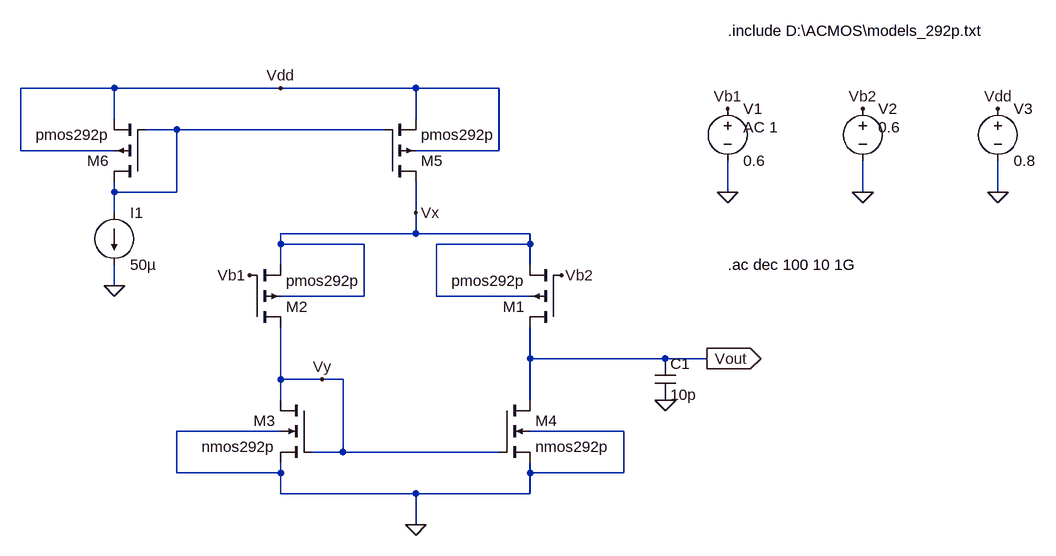
[diagram p0: schematic 5T_OTA_pmos.asc]
5T_OTA_pmos.asc, the LTspice schematic file:
Version 4.1
SHEET 1 1120 680
WIRE -304 -176 -448 -176
WIRE -48 -176 -304 -176
WIRE 160 -176 -48 -176
WIRE 288 -176 160 -176
WIRE -304 -128 -304 -176
WIRE 160 -128 160 -176
WIRE -208 -112 -256 -112
WIRE 112 -112 -208 -112
WIRE -448 -80 -448 -176
WIRE -304 -80 -448 -80
WIRE 288 -80 288 -176
WIRE 288 -80 160 -80
WIRE -304 -16 -304 -32
WIRE -208 -16 -208 -112
WIRE -208 -16 -304 -16
WIRE 640 -16 640 -64
WIRE 848 -16 848 -64
WIRE 1056 -16 1056 -64
WIRE -304 16 -304 -16
WIRE 160 16 160 -32
WIRE 160 48 160 16
WIRE 160 48 -48 48
WIRE 336 48 160 48
WIRE -48 64 -48 48
WIRE 80 64 -48 64
WIRE 336 64 336 48
WIRE 336 64 192 64
WIRE -48 96 -48 64
WIRE 336 96 336 64
WIRE -304 128 -304 96
WIRE 80 144 80 64
WIRE 80 144 -48 144
WIRE 192 144 192 64
WIRE 336 144 192 144
WIRE 336 240 336 192
WIRE 544 240 336 240
WIRE 608 240 544 240
WIRE -48 272 -48 192
WIRE 16 272 -48 272
WIRE 48 272 16 272
WIRE -48 304 -48 272
WIRE 336 304 336 240
WIRE -48 352 -208 352
WIRE 480 352 336 352
WIRE 48 384 48 272
WIRE 48 384 0 384
WIRE 288 384 48 384
WIRE -208 416 -208 352
WIRE -48 416 -48 400
WIRE -48 416 -208 416
WIRE 336 416 336 400
WIRE 480 416 480 352
WIRE 480 416 336 416
WIRE -48 448 -48 416
WIRE 160 448 -48 448
WIRE 336 448 336 416
WIRE 336 448 160 448
WIRE 160 496 160 448
FLAG 160 496 0
FLAG -304 128 0
FLAG 640 -16 0
FLAG 848 -16 0
FLAG 1056 -16 0
FLAG 640 -144 Vb1
FLAG 848 -144 Vb2
FLAG 1056 -144 Vdd
FLAG -96 112 Vb1
FLAG 384 112 Vb2
FLAG 608 240 Vout
IOPIN 608 240 Out
FLAG -48 -176 Vdd
FLAG 160 16 Vx
FLAG 16 272 Vy
FLAG 544 304 0
SYMBOL pmos4 384 192 R180
SYMATTR InstName M1
SYMATTR Value pmos292p
SYMATTR Value2 l=180n w=2.81532E-06
SYMBOL pmos4 -96 192 M180
SYMATTR InstName M2
SYMATTR Value pmos292p
SYMATTR Value2 l=180n w=2.81532E-06
SYMBOL nmos4 0 304 M0
SYMATTR InstName M3
SYMATTR Value nmos292p
SYMATTR Value2 l=720n w=4.31034E-06
SYMBOL nmos4 288 304 R0
SYMATTR InstName M4
SYMATTR Value nmos292p
SYMATTR Value2 l=720n w=4.31034E-06
SYMBOL pmos4 112 -32 M180
SYMATTR InstName M5
SYMATTR Value pmos292p
SYMATTR Value2 l=180n w=1u
SYMBOL pmos4 -256 -32 R180
SYMATTR InstName M6
SYMATTR Value pmos292p
SYMATTR Value2 l=180n w=1u
SYMBOL current -304 16 R0
WINDOW 123 0 0 Left 0
WINDOW 39 0 0 Left 0
SYMATTR InstName I1
SYMATTR Value 50µ
SYMBOL voltage 640 -160 R0
WINDOW 123 24 44 Left 2
WINDOW 39 0 0 Left 0
SYMATTR Value2 AC 1
SYMATTR InstName V1
SYMATTR Value 0.6
SYMBOL voltage 848 -160 R0
WINDOW 3 24 44 Left 2
WINDOW 123 24 72 Left 2
WINDOW 39 0 0 Left 0
SYMATTR Value 0.6
SYMATTR InstName V2
SYMBOL voltage 1056 -160 R0
WINDOW 123 0 0 Left 0
WINDOW 39 0 0 Left 0
SYMATTR InstName V3
SYMATTR Value 0.8
SYMBOL cap 528 240 R0
SYMATTR InstName C1
SYMATTR Value 10p
TEXT 640 -264 Left 2 !.include D:\\ACMOS\\models_292p.txt
TEXT 640 96 Left 2 !.ac dec 100 10 1G

The netlist it stands for:
* 5T_OTA_pmos.asc
M1 Vout Vb2 Vx Vx pmos292p l=180n w=2.81532E-06
M2 Vy Vb1 Vx Vx pmos292p l=180n w=2.81532E-06
M3 Vy Vy 0 0 nmos292p l=720n w=4.31034E-06
M4 Vout Vy 0 0 nmos292p l=720n w=4.31034E-06
M5 Vx N001 Vdd Vdd pmos292p l=180n w=1u
M6 N001 N001 Vdd Vdd pmos292p l=180n w=1u
I1 N001 0 50µ
V1 Vb1 0 0.6 AC 1
V2 Vb2 0 0.6
V3 Vdd 0 0.8
C1 Vout 0 10p
.model NMOS NMOS
.model PMOS PMOS
.lib standard.mos
.include D:\ACMOS\models_292p.txt
.ac dec 100 10 1G
.backanno
.end